# Altium schematic sheet jubeat_io_board.SchDoc
size A4
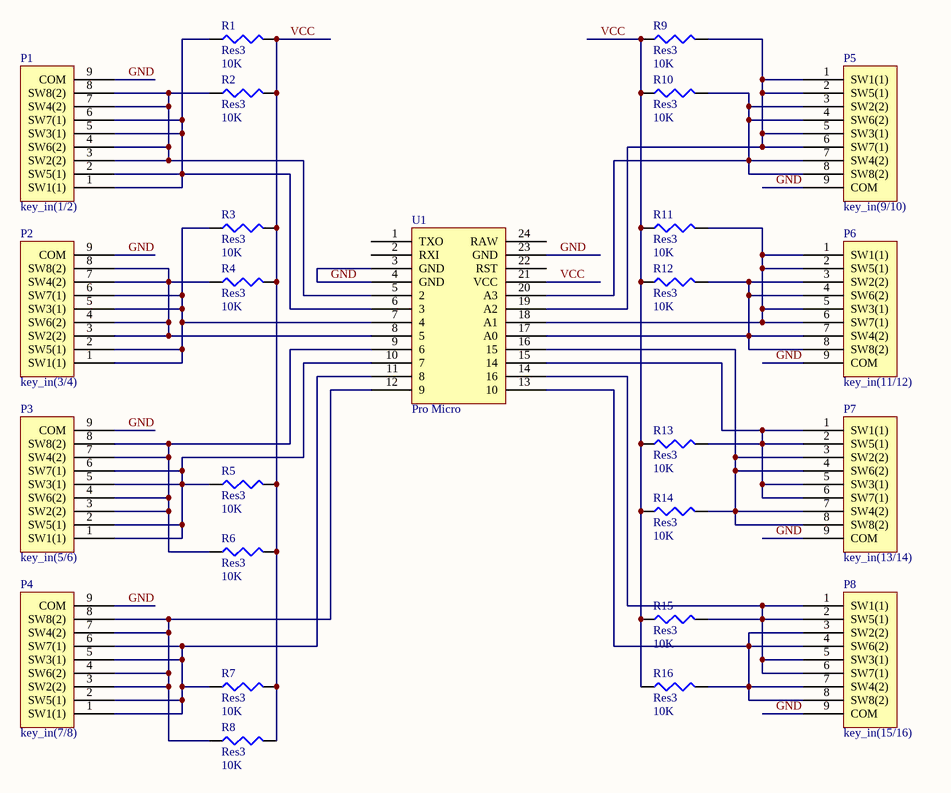
[diagram p0: jubeat_io_board.SchDoc]

## Parts
P1  key_in(1/2)  [PH2.0-WI-9P]
P2  key_in(3/4)  [PH2.0-WI-9P]
P3  key_in(5/6)  [PH2.0-WI-9P]
P4  key_in(7/8)  [PH2.0-WI-9P]
P5  key_in(9/10)  [PH2.0-WI-9P]
P6  key_in(11/12)  [PH2.0-WI-9P]
P7  key_in(13/14)  [PH2.0-WI-9P]
P8  key_in(15/16)  [PH2.0-WI-9P]
R1  Res3  value 10K  [J1-0603]
R2  Res3  value 10K  [J1-0603]
R3  Res3  value 10K  [J1-0603]
R4  Res3  value 10K  [J1-0603]
R5  Res3  value 10K  [J1-0603]
R6  Res3  value 10K  [J1-0603]
R7  Res3  value 10K  [J1-0603]
R8  Res3  value 10K  [J1-0603]
R9  Res3  value 10K  [J1-0603]
R10  Res3  value 10K  [J1-0603]
R11  Res3  value 10K  [J1-0603]
R12  Res3  value 10K  [J1-0603]
R13  Res3  value 10K  [J1-0603]
R14  Res3  value 10K  [J1-0603]
R15  Res3  value 10K  [J1-0603]
R16  Res3  value 10K  [J1-0603]
U1  Pro Micro  [PRO MICRO]

## Nets
GND: P1.9(COM) P2.9(COM) P3.9(COM) P4.9(COM) P5.9(COM) P6.9(COM) P7.9(COM) P8.9(COM) U1.3(GND) U1.4(GND) U1.23(GND)
VCC: R1.2 R2.2 R3.2 R4.2 R5.2 R6.2 R7.2 R8.2 R9.1 R10.1 R11.1 R12.1 R13.1 R14.1 R15.1 R16.1 U1.21(VCC)
NetP1_1: P1.1(SW1(1)) P1.2(SW5(1)) P1.5(SW3(1)) P1.6(SW7(1)) R1.1 U1.6(3)
NetP1_3: P1.3(SW2(2)) P1.4(SW6(2)) P1.7(SW4(2)) P1.8(SW8(2)) R2.1 U1.5(2)
NetP2_1: P2.1(SW1(1)) P2.2(SW5(1)) P2.5(SW3(1)) P2.6(SW7(1)) R3.1 U1.7(4)
NetP2_3: P2.3(SW2(2)) P2.4(SW6(2)) P2.7(SW4(2)) P2.8(SW8(2)) R4.1 U1.8(5)
NetP3_1: P3.1(SW1(1)) P3.2(SW5(1)) P3.5(SW3(1)) P3.6(SW7(1)) R5.1 U1.10(7)
NetP3_3: P3.3(SW2(2)) P3.4(SW6(2)) P3.7(SW4(2)) P3.8(SW8(2)) R6.1 U1.9(6)
NetP4_1: P4.1(SW1(1)) P4.2(SW5(1)) P4.5(SW3(1)) P4.6(SW7(1)) R7.1 U1.11(8)
NetP4_3: P4.3(SW2(2)) P4.4(SW6(2)) P4.7(SW4(2)) P4.8(SW8(2)) R8.1 U1.12(9)
NetP5_1: P5.1(SW1(1)) P5.2(SW5(1)) P5.5(SW3(1)) P5.6(SW7(1)) R9.2 U1.19(A2)
NetP5_3: P5.3(SW2(2)) P5.4(SW6(2)) P5.7(SW4(2)) P5.8(SW8(2)) R10.2 U1.20(A3)
NetP6_1: P6.1(SW1(1)) P6.2(SW5(1)) P6.5(SW3(1)) P6.6(SW7(1)) R11.2 U1.18(A1)
NetP6_3: P6.3(SW2(2)) P6.4(SW6(2)) P6.7(SW4(2)) P6.8(SW8(2)) R12.2 U1.17(A0)
NetP7_1: P7.1(SW1(1)) P7.2(SW5(1)) P7.5(SW3(1)) P7.6(SW7(1)) R13.2 U1.15(14)
NetP7_3: P7.3(SW2(2)) P7.4(SW6(2)) P7.7(SW4(2)) P7.8(SW8(2)) R14.2 U1.16(15)
NetP8_1: P8.1(SW1(1)) P8.2(SW5(1)) P8.5(SW3(1)) P8.6(SW7(1)) R15.2 U1.14(16)
NetP8_3: P8.3(SW2(2)) P8.4(SW6(2)) P8.7(SW4(2)) P8.8(SW8(2)) R16.2 U1.13(10)

Not connected (* = marked no-connect by the designer): U1 1(TXO) 2(RXI) 22(RST) 24(RAW)

## Library data of the parts
P1-P8 = key_in: Button PCB Board Connector, PH2.00mm
R1-R16 = Res3: Resistor; Published: 8-Jun-2000; LatestRevisionDate: 29-May-2009; LatestRevisionNote: IPC-7351 Footprint Added.; PackageReference: J1-0603; Publisher: Altium Limited; PackageDescription: Chip Resistor
U1 = Pro Micro: Pro Micro Arduino Board